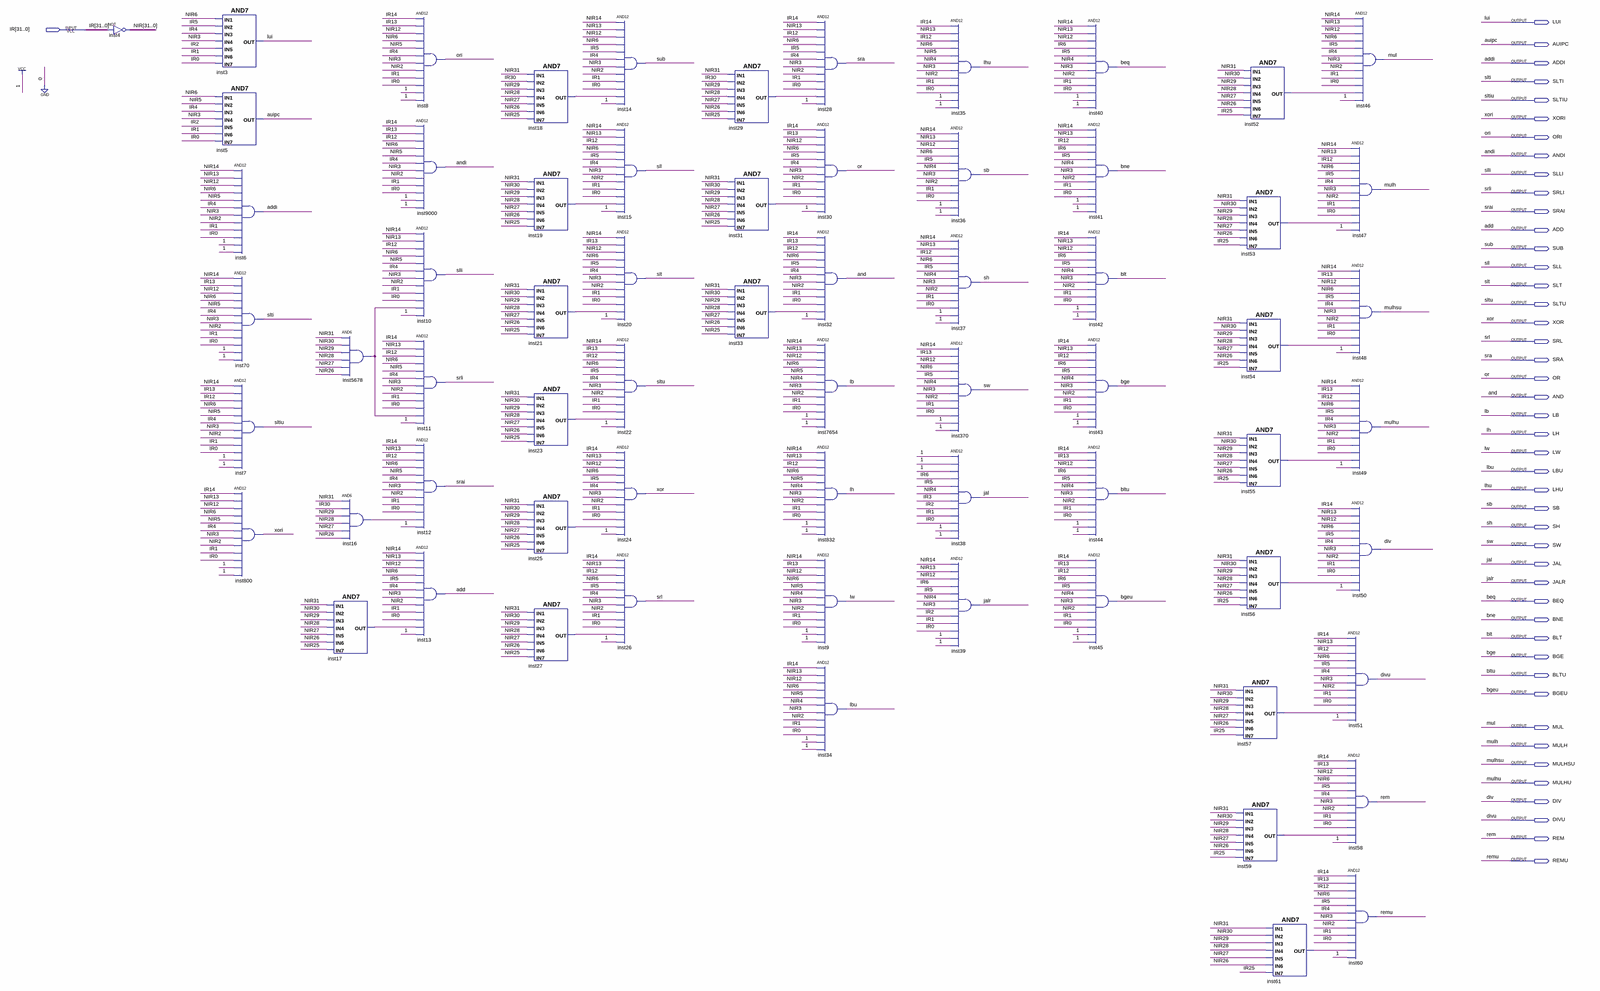
[diagram p0: schematic sheet, whole]
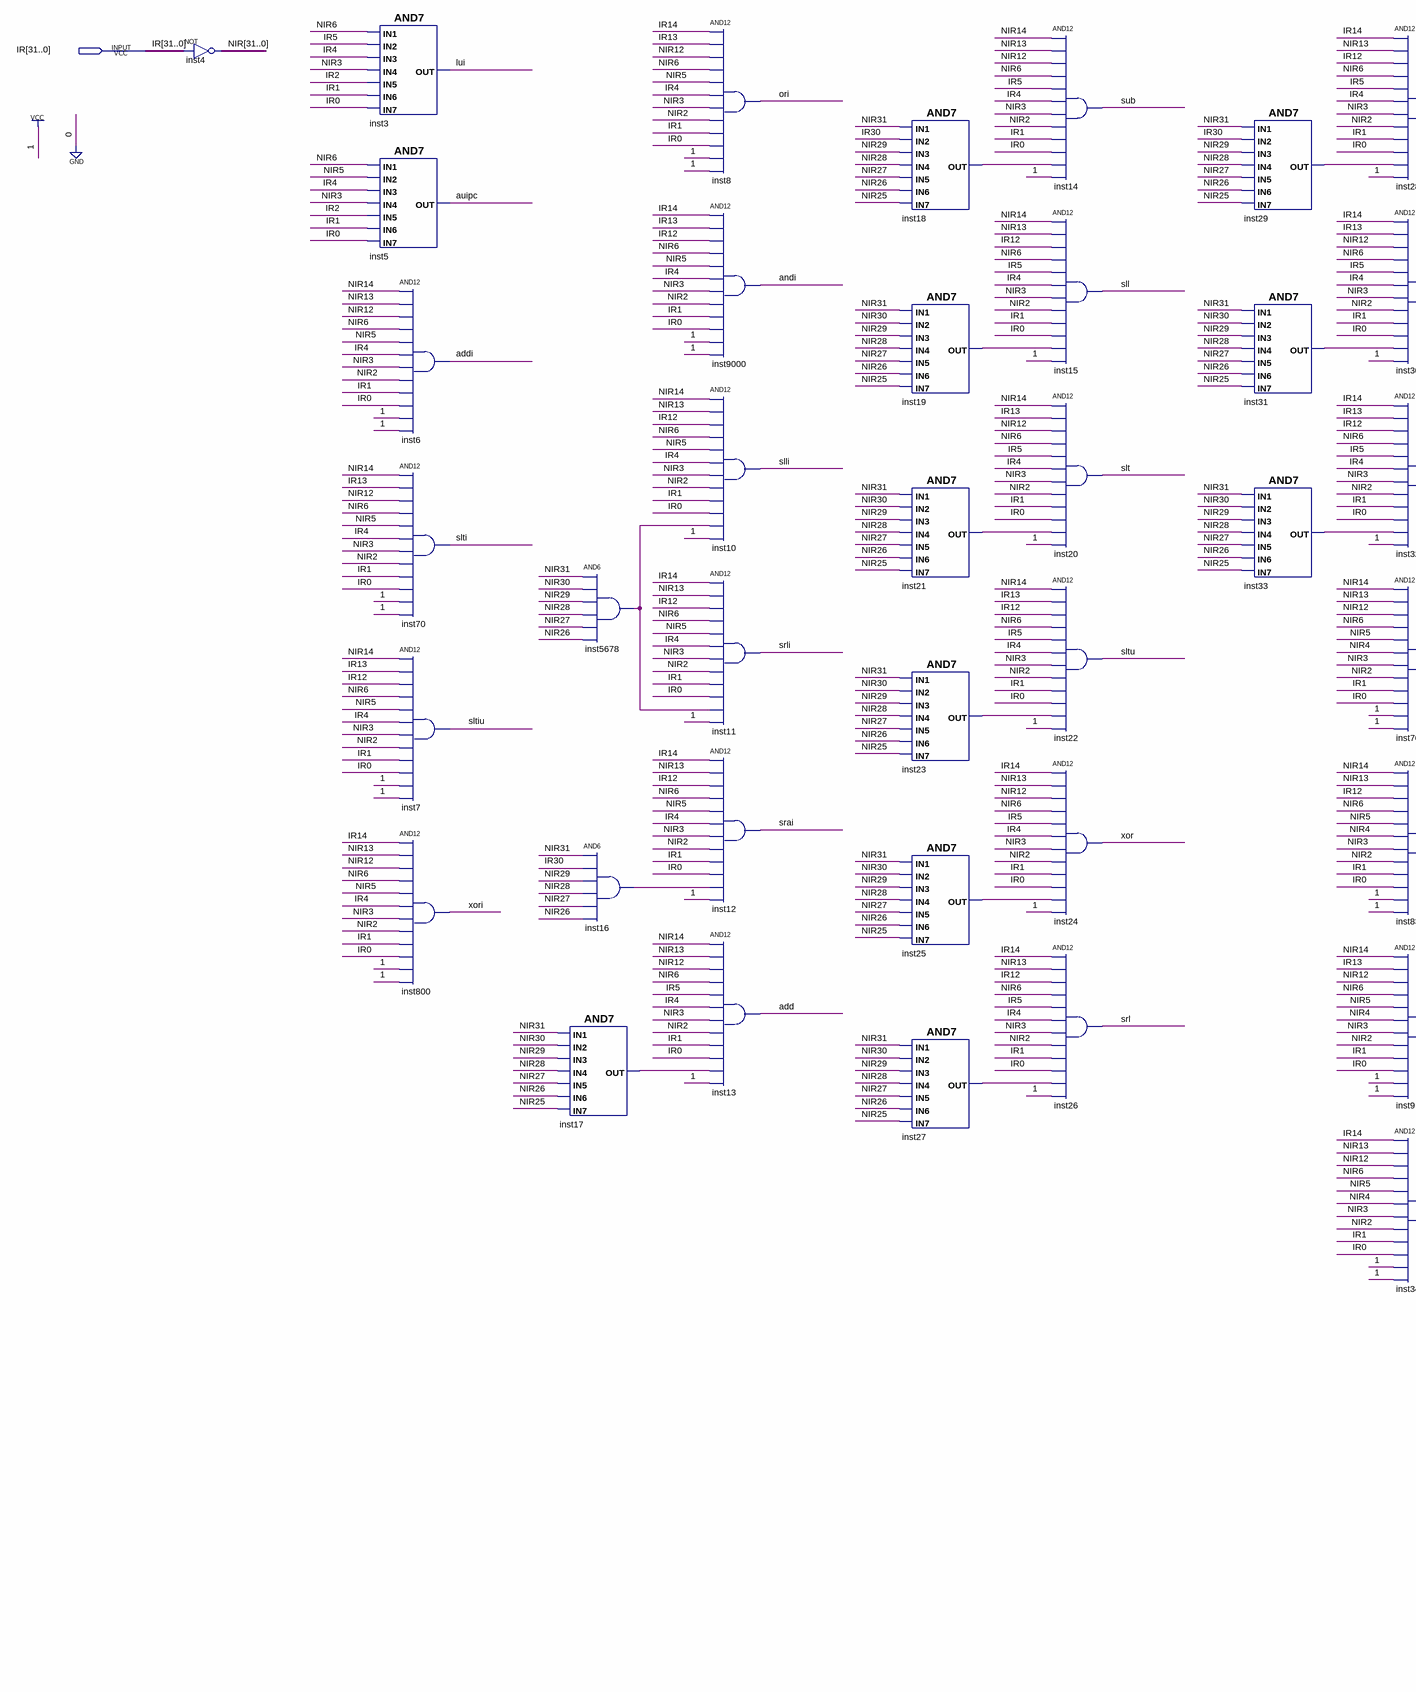
[diagram p1: schematic sheet, left part]
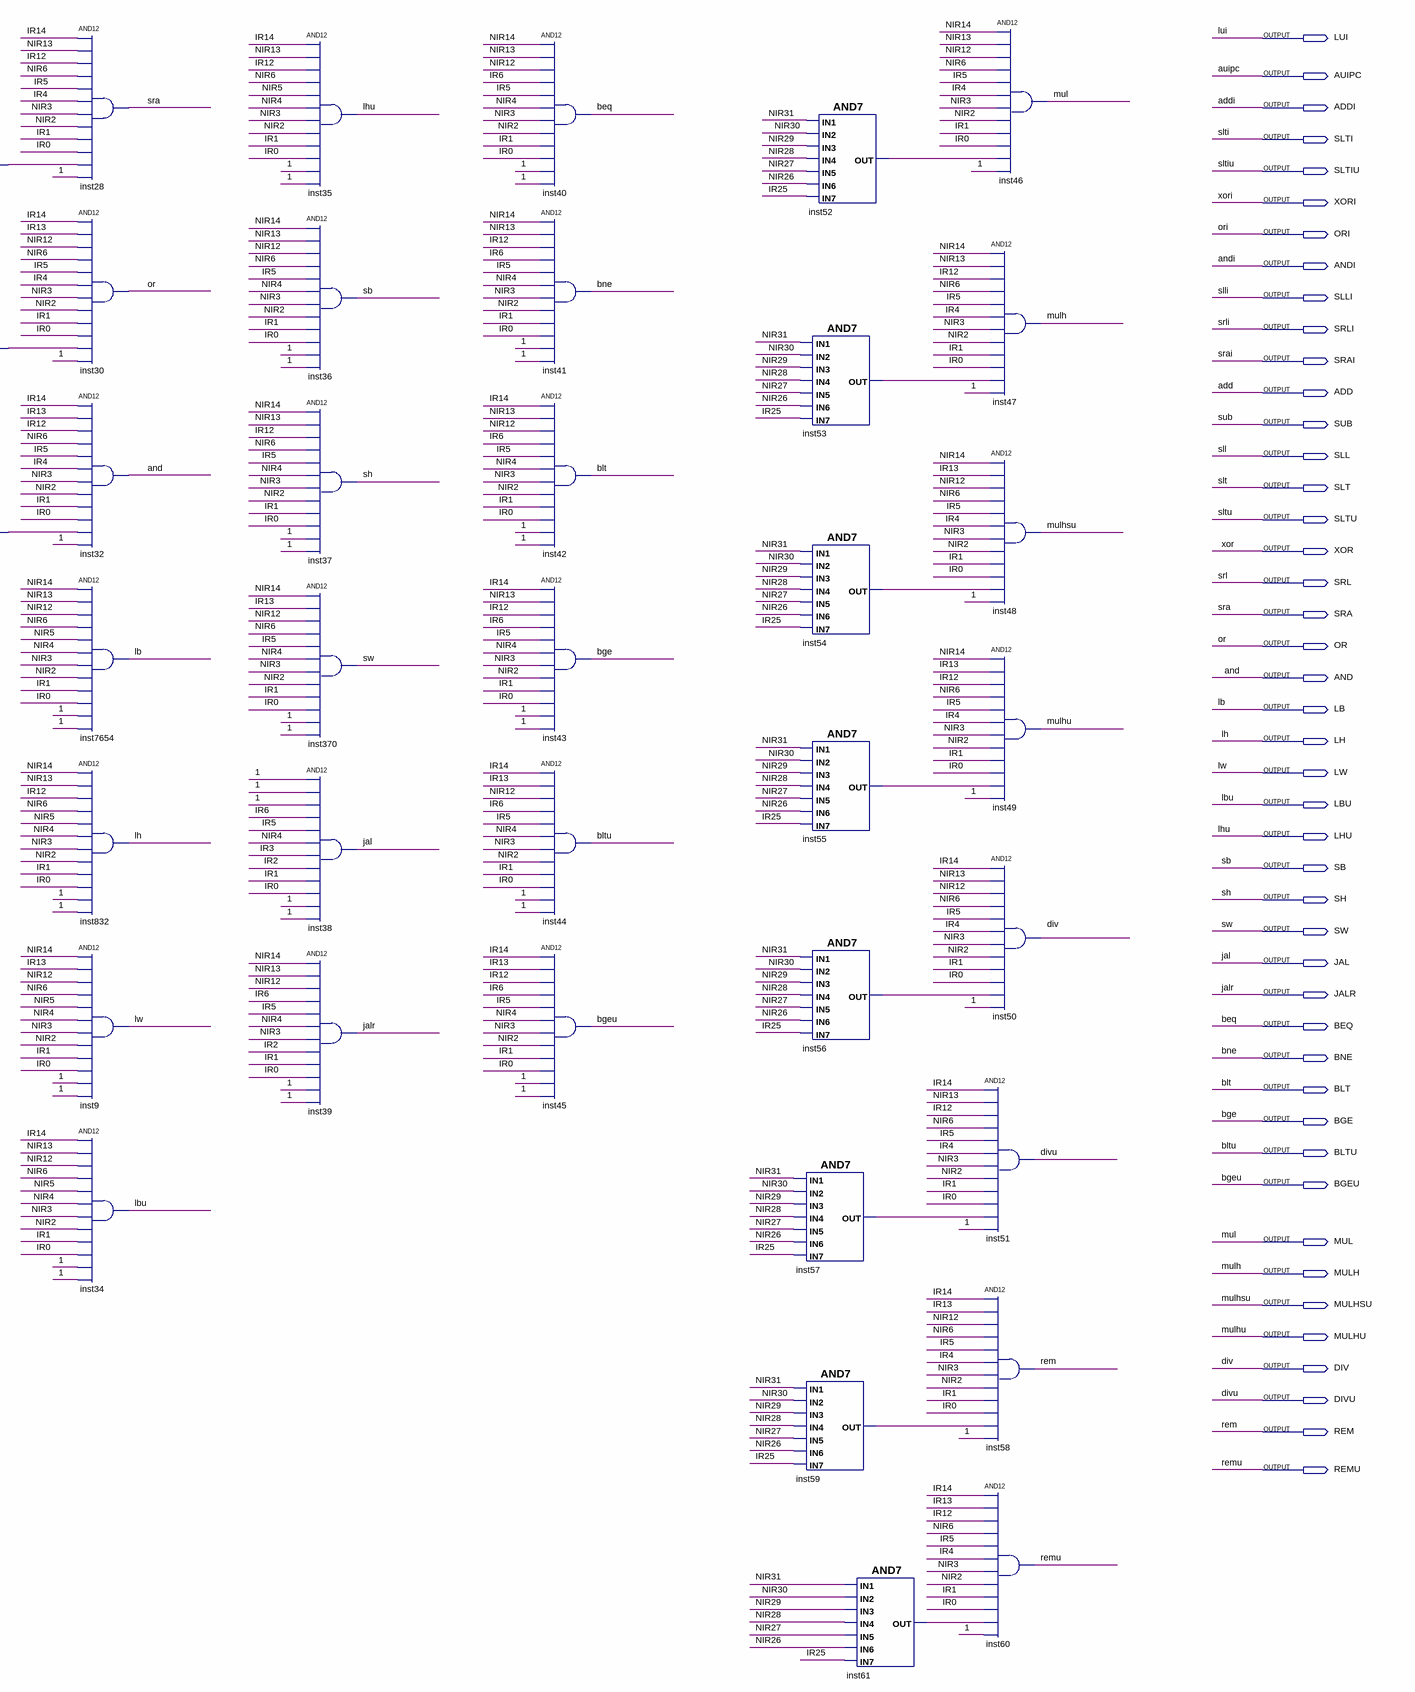
[diagram p2: schematic sheet, right part]
// Quartus schematic ir_opcode.bdf as structural Verilog: 66 symbols, 46 pins
module ir_opcode (
  input  [31:0] IR,
  output LUI,
  output AUIPC,
  output ADDI,
  output SLTI,
  output SLTIU,
  output XORI,
  output ORI,
  output ANDI,
  output SLLI,
  output SRLI,
  output SRAI,
  output ADD,
  output SUB,
  output SLL,
  output SLT,
  output SLTU,
  output XOR,
  output SRL,
  output SRA,
  output OR,
  output AND,
  output LB,
  output LH,
  output LW,
  output LBU,
  output LHU,
  output SB,
  output SH,
  output SW,
  output JAL,
  output JALR,
  output BEQ,
  output BNE,
  output BLT,
  output BGE,
  output BLTU,
  output BGEU,
  output MUL,
  output MULH,
  output MULHSU,
  output MULHU,
  output DIV,
  output DIVU,
  output REM,
  output REMU
);

  wire inst16_out, inst17_out, inst18_out, inst19_out, inst21_out, inst23_out, inst25_out, inst27_out,
       inst29_out, inst31_out, inst33_out, inst52_out, inst53_out, inst54_out, inst55_out, inst56_out,
       inst57_out, inst59_out, inst61_out, inst5678_out;
  wire [31:0] NIR;

  assign NIR = ~IR;  // NOT inst4, 32 bits wide
  and inst3 (LUI, NIR[6], IR[5], IR[4], NIR[3], IR[2], IR[1], IR[0]);
  and inst5 (AUIPC, NIR[6], NIR[5], IR[4], NIR[3], IR[2], IR[1], IR[0]);
  and inst6 (ADDI, NIR[14], NIR[13], NIR[12], NIR[6], NIR[5], IR[4], NIR[3], NIR[2], IR[1], IR[0], 1'b1, 1'b1);
  and inst70 (SLTI, NIR[14], IR[13], NIR[12], NIR[6], NIR[5], IR[4], NIR[3], NIR[2], IR[1], IR[0], 1'b1, 1'b1);
  and inst7 (SLTIU, NIR[14], IR[13], IR[12], NIR[6], NIR[5], IR[4], NIR[3], NIR[2], IR[1], IR[0], 1'b1, 1'b1);
  and inst800 (XORI, IR[14], NIR[13], NIR[12], NIR[6], NIR[5], IR[4], NIR[3], NIR[2], IR[1], IR[0], 1'b1, 1'b1);
  and inst5678 (inst5678_out, NIR[31], NIR[30], NIR[29], NIR[28], NIR[27], NIR[26]);
  and inst16 (inst16_out, NIR[31], IR[30], NIR[29], NIR[28], NIR[27], NIR[26]);
  and inst17 (inst17_out, NIR[31], NIR[30], NIR[29], NIR[28], NIR[27], NIR[26], NIR[25]);
  and inst8 (ORI, IR[14], IR[13], NIR[12], NIR[6], NIR[5], IR[4], NIR[3], NIR[2], IR[1], IR[0], 1'b1, 1'b1);
  and inst9000 (ANDI, IR[14], IR[13], IR[12], NIR[6], NIR[5], IR[4], NIR[3], NIR[2], IR[1], IR[0], 1'b1, 1'b1);
  and inst10 (SLLI, NIR[14], NIR[13], IR[12], NIR[6], NIR[5], IR[4], NIR[3], NIR[2], IR[1], IR[0], inst5678_out, 1'b1);
  and inst11 (SRLI, IR[14], NIR[13], IR[12], NIR[6], NIR[5], IR[4], NIR[3], NIR[2], IR[1], IR[0], inst5678_out, 1'b1);
  and inst12 (SRAI, IR[14], NIR[13], IR[12], NIR[6], NIR[5], IR[4], NIR[3], NIR[2], IR[1], IR[0], inst16_out, 1'b1);
  and inst13 (ADD, NIR[14], NIR[13], NIR[12], NIR[6], IR[5], IR[4], NIR[3], NIR[2], IR[1], IR[0], inst17_out, 1'b1);
  and inst18 (inst18_out, NIR[31], IR[30], NIR[29], NIR[28], NIR[27], NIR[26], NIR[25]);
  and inst19 (inst19_out, NIR[31], NIR[30], NIR[29], NIR[28], NIR[27], NIR[26], NIR[25]);
  and inst21 (inst21_out, NIR[31], NIR[30], NIR[29], NIR[28], NIR[27], NIR[26], NIR[25]);
  and inst23 (inst23_out, NIR[31], NIR[30], NIR[29], NIR[28], NIR[27], NIR[26], NIR[25]);
  and inst25 (inst25_out, NIR[31], NIR[30], NIR[29], NIR[28], NIR[27], NIR[26], NIR[25]);
  and inst27 (inst27_out, NIR[31], NIR[30], NIR[29], NIR[28], NIR[27], NIR[26], NIR[25]);
  and inst14 (SUB, NIR[14], NIR[13], NIR[12], NIR[6], IR[5], IR[4], NIR[3], NIR[2], IR[1], IR[0], inst18_out, 1'b1);
  and inst15 (SLL, NIR[14], NIR[13], IR[12], NIR[6], IR[5], IR[4], NIR[3], NIR[2], IR[1], IR[0], inst19_out, 1'b1);
  and inst20 (SLT, NIR[14], IR[13], NIR[12], NIR[6], IR[5], IR[4], NIR[3], NIR[2], IR[1], IR[0], inst21_out, 1'b1);
  and inst22 (SLTU, NIR[14], IR[13], IR[12], NIR[6], IR[5], IR[4], NIR[3], NIR[2], IR[1], IR[0], inst23_out, 1'b1);
  and inst24 (XOR, IR[14], NIR[13], NIR[12], NIR[6], IR[5], IR[4], NIR[3], NIR[2], IR[1], IR[0], inst25_out, 1'b1);
  and inst26 (SRL, IR[14], NIR[13], IR[12], NIR[6], IR[5], IR[4], NIR[3], NIR[2], IR[1], IR[0], inst27_out, 1'b1);
  and inst29 (inst29_out, NIR[31], IR[30], NIR[29], NIR[28], NIR[27], NIR[26], NIR[25]);
  and inst31 (inst31_out, NIR[31], NIR[30], NIR[29], NIR[28], NIR[27], NIR[26], NIR[25]);
  and inst33 (inst33_out, NIR[31], NIR[30], NIR[29], NIR[28], NIR[27], NIR[26], NIR[25]);
  and inst28 (SRA, IR[14], NIR[13], IR[12], NIR[6], IR[5], IR[4], NIR[3], NIR[2], IR[1], IR[0], inst29_out, 1'b1);
  and inst30 (OR, IR[14], IR[13], NIR[12], NIR[6], IR[5], IR[4], NIR[3], NIR[2], IR[1], IR[0], inst31_out, 1'b1);
  and inst32 (AND, IR[14], IR[13], IR[12], NIR[6], IR[5], IR[4], NIR[3], NIR[2], IR[1], IR[0], inst33_out, 1'b1);
  and inst7654 (LB, NIR[14], NIR[13], NIR[12], NIR[6], NIR[5], NIR[4], NIR[3], NIR[2], IR[1], IR[0], 1'b1, 1'b1);
  and inst832 (LH, NIR[14], NIR[13], IR[12], NIR[6], NIR[5], NIR[4], NIR[3], NIR[2], IR[1], IR[0], 1'b1, 1'b1);
  and inst9 (LW, NIR[14], IR[13], NIR[12], NIR[6], NIR[5], NIR[4], NIR[3], NIR[2], IR[1], IR[0], 1'b1, 1'b1);
  and inst34 (LBU, IR[14], NIR[13], NIR[12], NIR[6], NIR[5], NIR[4], NIR[3], NIR[2], IR[1], IR[0], 1'b1, 1'b1);
  and inst35 (LHU, IR[14], NIR[13], IR[12], NIR[6], NIR[5], NIR[4], NIR[3], NIR[2], IR[1], IR[0], 1'b1, 1'b1);
  and inst36 (SB, NIR[14], NIR[13], NIR[12], NIR[6], IR[5], NIR[4], NIR[3], NIR[2], IR[1], IR[0], 1'b1, 1'b1);
  and inst37 (SH, NIR[14], NIR[13], IR[12], NIR[6], IR[5], NIR[4], NIR[3], NIR[2], IR[1], IR[0], 1'b1, 1'b1);
  and inst370 (SW, NIR[14], IR[13], NIR[12], NIR[6], IR[5], NIR[4], NIR[3], NIR[2], IR[1], IR[0], 1'b1, 1'b1);
  and inst38 (JAL, 1'b1, 1'b1, 1'b1, IR[6], IR[5], NIR[4], IR[3], IR[2], IR[1], IR[0], 1'b1, 1'b1);
  and inst39 (JALR, NIR[14], NIR[13], NIR[12], IR[6], IR[5], NIR[4], NIR[3], IR[2], IR[1], IR[0], 1'b1, 1'b1);
  and inst40 (BEQ, NIR[14], NIR[13], NIR[12], IR[6], IR[5], NIR[4], NIR[3], NIR[2], IR[1], IR[0], 1'b1, 1'b1);
  and inst41 (BNE, NIR[14], NIR[13], IR[12], IR[6], IR[5], NIR[4], NIR[3], NIR[2], IR[1], IR[0], 1'b1, 1'b1);
  and inst42 (BLT, IR[14], NIR[13], NIR[12], IR[6], IR[5], NIR[4], NIR[3], NIR[2], IR[1], IR[0], 1'b1, 1'b1);
  and inst43 (BGE, IR[14], NIR[13], IR[12], IR[6], IR[5], NIR[4], NIR[3], NIR[2], IR[1], IR[0], 1'b1, 1'b1);
  and inst44 (BLTU, IR[14], IR[13], NIR[12], IR[6], IR[5], NIR[4], NIR[3], NIR[2], IR[1], IR[0], 1'b1, 1'b1);
  and inst45 (BGEU, IR[14], IR[13], IR[12], IR[6], IR[5], NIR[4], NIR[3], NIR[2], IR[1], IR[0], 1'b1, 1'b1);
  and inst57 (inst57_out, NIR[31], NIR[30], NIR[29], NIR[28], NIR[27], NIR[26], IR[25]);
  and inst59 (inst59_out, NIR[31], NIR[30], NIR[29], NIR[28], NIR[27], NIR[26], IR[25]);
  and inst52 (inst52_out, NIR[31], NIR[30], NIR[29], NIR[28], NIR[27], NIR[26], IR[25]);
  and inst53 (inst53_out, NIR[31], NIR[30], NIR[29], NIR[28], NIR[27], NIR[26], IR[25]);
  and inst54 (inst54_out, NIR[31], NIR[30], NIR[29], NIR[28], NIR[27], NIR[26], IR[25]);
  and inst55 (inst55_out, NIR[31], NIR[30], NIR[29], NIR[28], NIR[27], NIR[26], IR[25]);
  and inst56 (inst56_out, NIR[31], NIR[30], NIR[29], NIR[28], NIR[27], NIR[26], IR[25]);
  and inst61 (inst61_out, NIR[31], NIR[30], NIR[29], NIR[28], NIR[27], NIR[26], IR[25]);
  and inst46 (MUL, NIR[14], NIR[13], NIR[12], NIR[6], IR[5], IR[4], NIR[3], NIR[2], IR[1], IR[0], inst52_out, 1'b1);
  and inst47 (MULH, NIR[14], NIR[13], IR[12], NIR[6], IR[5], IR[4], NIR[3], NIR[2], IR[1], IR[0], inst53_out, 1'b1);
  and inst48 (MULHSU, NIR[14], IR[13], NIR[12], NIR[6], IR[5], IR[4], NIR[3], NIR[2], IR[1], IR[0], inst54_out, 1'b1);
  and inst49 (MULHU, NIR[14], IR[13], IR[12], NIR[6], IR[5], IR[4], NIR[3], NIR[2], IR[1], IR[0], inst55_out, 1'b1);
  and inst50 (DIV, IR[14], NIR[13], NIR[12], NIR[6], IR[5], IR[4], NIR[3], NIR[2], IR[1], IR[0], inst56_out, 1'b1);
  and inst51 (DIVU, IR[14], NIR[13], IR[12], NIR[6], IR[5], IR[4], NIR[3], NIR[2], IR[1], IR[0], inst57_out, 1'b1);
  and inst58 (REM, IR[14], IR[13], NIR[12], NIR[6], IR[5], IR[4], NIR[3], NIR[2], IR[1], IR[0], inst59_out, 1'b1);
  and inst60 (REMU, IR[14], IR[13], IR[12], NIR[6], IR[5], IR[4], NIR[3], NIR[2], IR[1], IR[0], inst61_out, 1'b1);
endmodule
